# EAGLE design QFP_32U4 (EAGLE 7.2.0)
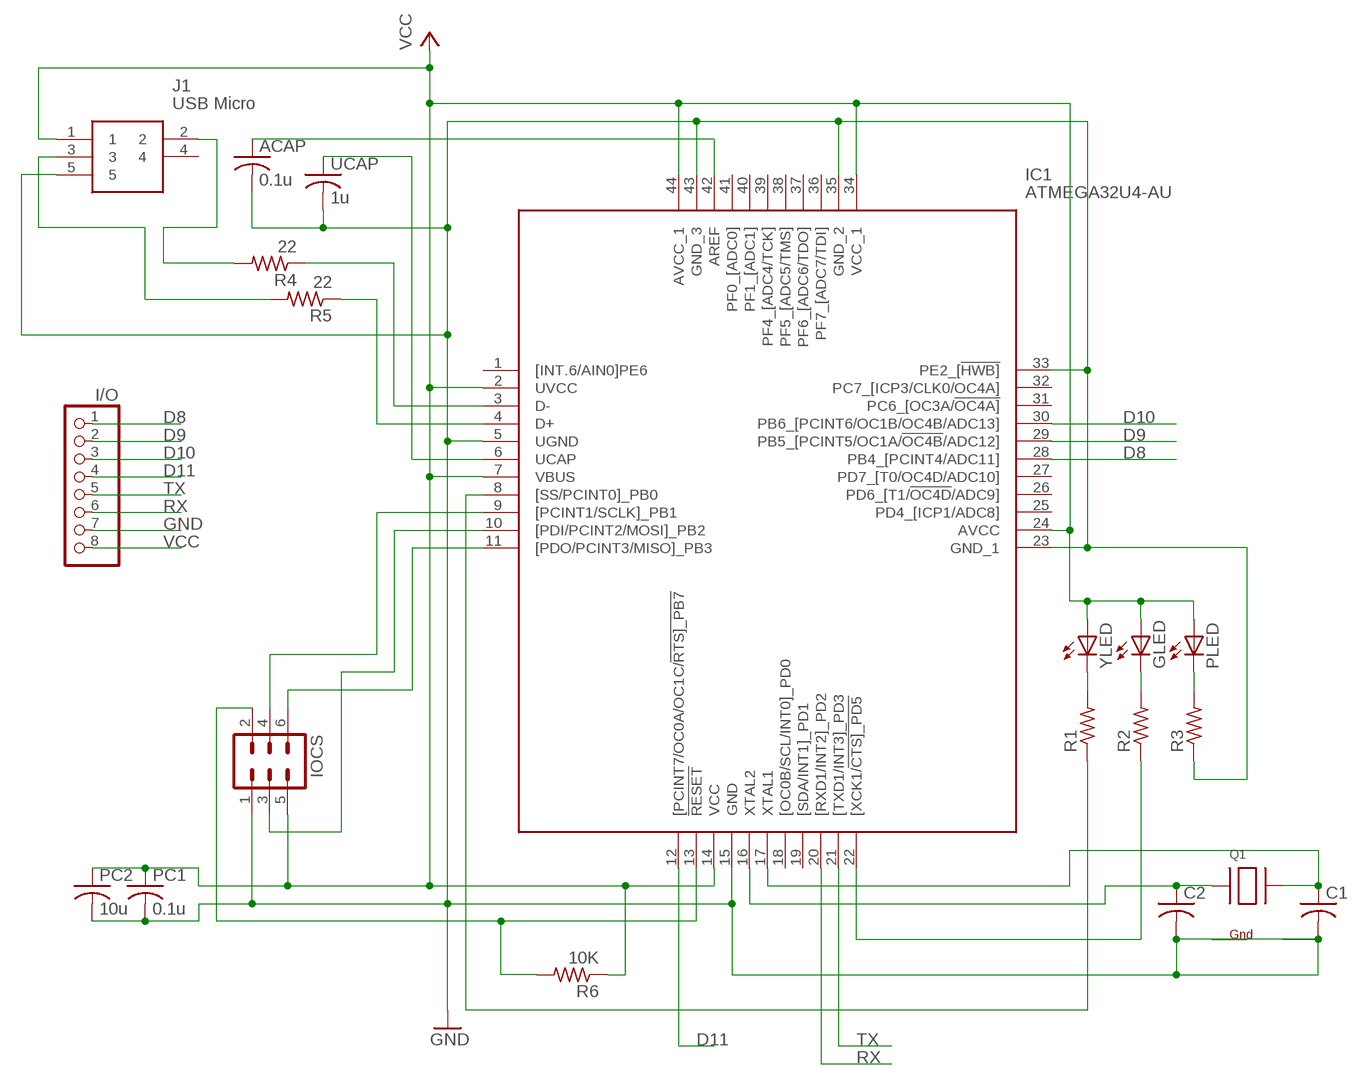
[diagram p0: schematic, sheet 1]

## Parts
ACAP  0.1u  C-USC0805  [C0805]
C1  C-USC0805  [C0805]
C2  C-USC0805  [C0805]
GLED  LEDCHIP-LED0805  [CHIP-LED0805]
I/O  PINHD-1X8CLEANBIG  [1X08-CLEANBIG]
IC1  ATMEGA32U4-AU  [QFP80P1200X1200X120-44N]
IOCS  MA03-2  [MA03-2]
J1  USB Micro  10104110-0001LF  [10104110-0001LF]
PC1  0.1u  C-USC0805  [C0805]
PC2  10u  C-USC0805  [C0805]
PLED  LEDCHIP-LED0805  [CHIP-LED0805]
Q1  XTAL-4-3225  [NX3225]
R1  R-US_M0805  [M0805]
R2  R-US_M0805  [M0805]
R3  R-US_M0805  [M0805]
R4  22  R-US_M0805  [M0805]
R5  22  R-US_M0805  [M0805]
R6  10K  R-US_M0805  [M0805]
UCAP  1u  C-USC0805  [C0805]
YLED  LEDCHIP-LED0805  [CHIP-LED0805]

## Nets
D8: I/O.1 IC1.28(PB4_[PCINT4/ADC11])
D9: I/O.2 IC1.29(PB5_[PCINT5/OC1A/!OC4B!/ADC12])
D10: I/O.3 IC1.30(PB6_[PCINT6/OC1B/OC4B/ADC13])
D11: I/O.4 IC1.12([PCINT7/OC0A/OC1C/!RTS]_PB7)
GND: ACAP.2 C1.2 C2.2 I/O.7 IC1.5(UGND) IC1.15(GND) IC1.23(GND_1) IC1.33(PE2_[!HWB]) IC1.35(GND_2) IC1.43(GND_3) IOCS.1 J1.5 PC1.2 PC2.2 Q1.2(G2) Q1.4(G1) R3.1 UCAP.2
N$3: IC1.3(D-) R4.1
N$4: IC1.4(D+) R5.1
N$5: J1.2 R4.2
N$6: IC1.6(UCAP) UCAP.1
N$7: R1.2 YLED.C
N$8: IC1.8([SS/PCINT0]_PB0) R1.1
N$9: IC1.9([PCINT1/SCLK]_PB1) IOCS.4
N$10: IC1.10([PDI/PCINT2/MOSI]_PB2) IOCS.3
N$11: IC1.11([PDO/PCINT3/MISO]_PB3) IOCS.6
N$13: IC1.13(!RESET) IOCS.2 R6.2
N$14: J1.3 R5.2
N$15: GLED.C R2.2
N$16: C2.1 IC1.16(XTAL2) Q1.1(X1)
N$22: IC1.22([XCK1/!CTS]_PD5) R2.1
N$23: PLED.C R3.2
N$35: C1.1 IC1.17(XTAL1) Q1.3(X2)
N$42: ACAP.1 IC1.42(AREF)
RX: I/O.6 IC1.20([RXD1/INT2]_PD2)
TX: I/O.5 IC1.21([TXD1/INT3]_PD3)
VCC: GLED.A I/O.8 IC1.2(UVCC) IC1.7(VBUS) IC1.14(VCC) IC1.24(AVCC) IC1.34(VCC_1) IC1.44(AVCC_1) IOCS.5 J1.1 PC1.1 PC2.1 PLED.A R6.1 YLED.A
Unconnected: IC1.1([INT.6/AIN0]PE6) IC1.18([OC0B/SCL/INT0]_PD0) IC1.19([SDA/INT1]_PD1) IC1.25(PD4_[ICP1/ADC8]) IC1.26(PD6_[T1/!OC4D!/ADC9]) IC1.27(PD7_[T0/OC4D/ADC10]) IC1.31(PC6_[OC3A/!OC4A]) IC1.32(PC7_[ICP3/CLK0/OC4A]) IC1.36(PF7_[ADC7/TDI]) IC1.37(PF6_[ADC6/TDO]) IC1.38(PF5_[ADC5/TMS]) IC1.39(PF4_[ADC4/TCK]) IC1.40(PF1_[ADC1]) IC1.41(PF0_[ADC0]) J1.4

## Library data of the parts
ACAP C1 C2 PC1 PC2 UCAP = adafruit:C-US: CAPACITOR, American symbol
GLED PLED YLED = adafruit:LED: LED OSRAM: - CHIPLED LG R971, LG N971, LY N971, LG Q971, LY Q971, LO R971, LY R971 LH N974, LH R974 LS Q976, LO Q976, LY Q976 LO Q996 - Hyper CHIPLED LW Q18S LB Q993, LB Q99A, LB R99A - SideLED LS A670, LO A670, LY A670, LG A670, LP A670 LB A673, LV A673, LT A673, LW A673 LH A674 LY A675 LS A676, LA A676, LO A676, LY A676, LW A676 LS A679, LY A679, LG A679 - Hyper Micro SIDELED® LS Y876, LA Y876, LO Y876, LY Y876 LT Y87S - SmartLED LW L88C, LW L88S LB L89C, LB L89S, LG L890 LS L89K, LO L89K, LY L89K LS L896, LA L896, LO L896, LY L896 - TOPLED LS T670, LO T670, LY T670, LG T670, LP T670 LSG T670, LSP T670, LSY T670, LOP T670, LYG T670 LG T671, LOG T671, LSG T671 LB T673, LV T673, LT T673, LW T673 LH T674 LS T676, LA T676, LO T676, LY T676, LB T676, LH T676, LSB T676, LW T676 LB T67C, LV T67C, LT T67C, LS T67K, LO T67K, LY T67K, LW E67C LS E67B, LA E67B, LO E67B, LY E67B, LB E67C, LV E67C, LT E67C LW T67C LS T679, LY T679, LG T679 LS T770, LO T770, LY T770, LG T770, LP T770 LB T773, LV T773, LT T773, LW T773 LH T774 LS E675, LA E675, LY E675, LS T675 LS T776, LA T776, LO T776, LY T776, LB T776 LHGB T686 LT T68C, LB T68C - Hyper Mini TOPLED® LB M676 - Mini TOPLED Santana® LG M470 LS M47K, LO M47K, LY M47K Source: http://www.osram.convergy.de/
I/O = adafruit:PINHD-1X8: PIN HEADER
IC1 = ATMEGA32U4-AU:ATMEGA32U4-AU: MCU AVR 32K FLASH 16MHZ 44-TQFP Atmel ATMEGA32U4-AU, 8bit AVR Microcontroller, 16MHz, 1 kB, 32 kB Flash, 44-Pin TQFP Source: Datasheet <http://www.atmel.com/images/atmel-7766-8-bit-avr-atmega16u4-32u4_summary.pdf>; ARROW_PART_NUMBER: ATMEGA32U4-AU; ARROW_PRICE-STOCK: https://www.arrow.com/en/products/atmega32u4-au/microchip-technology; DESCRIPTION: MCU AVR 32K FLASH 16MHZ 44-TQFP Atmel ATMEGA32U4-AU, 8bit AVR Microcontroller, 16MHz, 1 kB, 32 kB Flash, 44-Pin TQFP; HEIGHT: 1.2mm; MANUFACTURER_NAME: Microchip; MANUFACTURER_PART_NUMBER: ATMEGA32U4-AU; RS_PART_NUMBER: 1310289P; RS_PRICE-STOCK: http://uk.rs-online.com/web/p/products/1310289P
IOCS = con-lstb:MA03-2: PIN HEADER; OC_FARNELL: unknown; OC_NEWARK: unknown
J1 = USB-Micro_3:10104110-0001LF: USB Connectors 5P Quick Connect Micro USB TypeB Rcpt Source: Datasheet <http://docs-emea.rs-online.com/webdocs/0ed1/0900766b80ed1ae6.pdf>; ALLIED_NUMBER: 70236824; ALLIED_PRICE-STOCK: http://www.alliedelec.com/fci-10104110-0001lf/70236824/; ARROW_PART_NUMBER: 10104110-0001LF; ARROW_PRICE-STOCK: https://www.arrow.com/en/products/10104110-0001lf/amphenol-fci; DESCRIPTION: USB Connectors 5P Quick Connect Micro USB TypeB Rcpt; HEIGHT: mm; MANUFACTURER_NAME: FCI; MANUFACTURER_PART_NUMBER: 10104110-0001LF; RS_PART_NUMBER: 1738645; RS_PRICE-STOCK: http://uk.rs-online.com/web/p/products/1738645
Q1 = adafruit:XTAL-4: Classic 4-pin 3.2 x 2.5mm crystal
R1-R6 = adafruit:R-US_: RESISTOR, American symbol

## Net classes
0 default: width 0.3 mm, clearance 0.003 mm

## Board
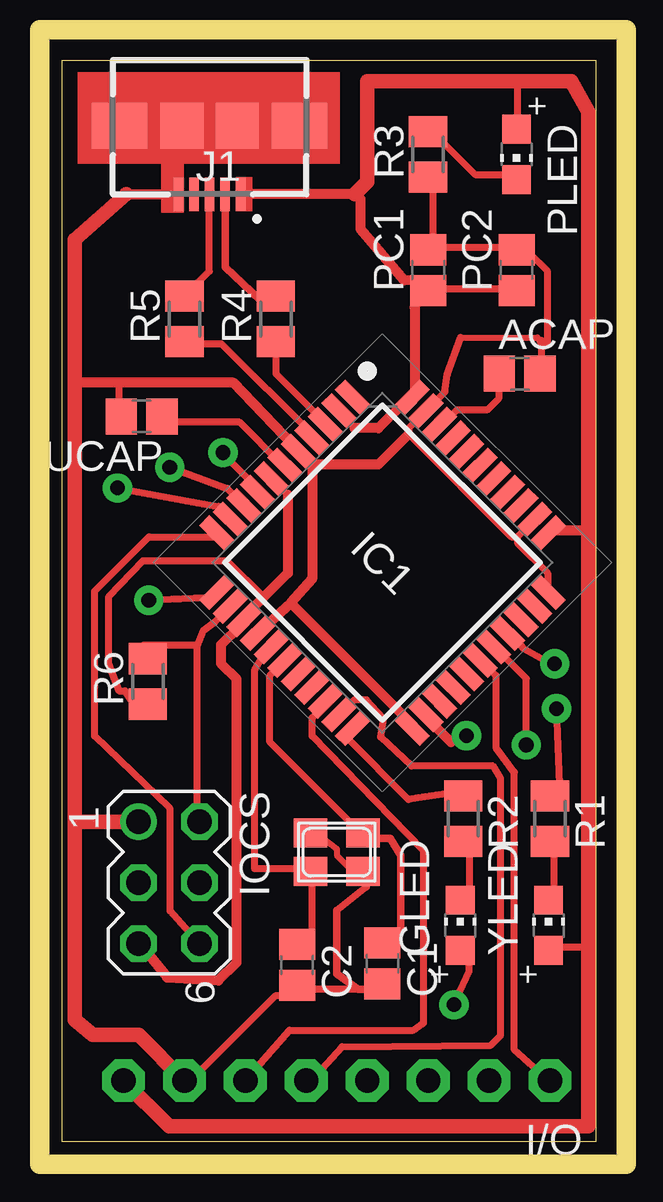
[diagram p1: board, top side]
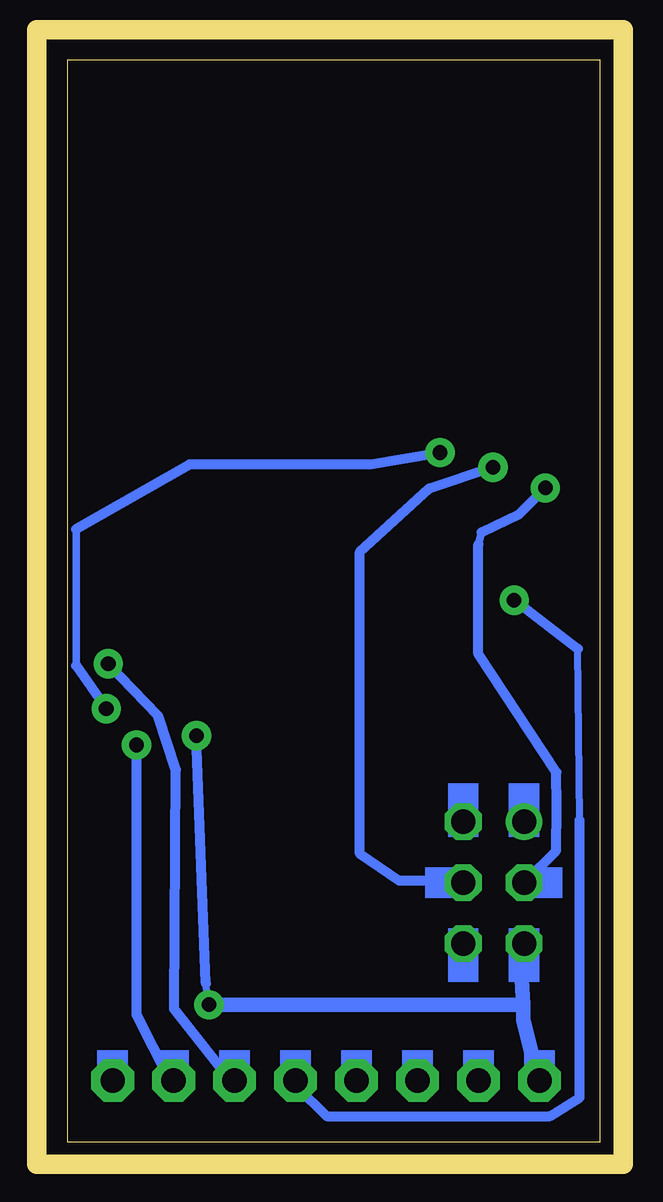
[diagram p2: board, bottom side, seen from below]

Size 22.23 x 45.09 mm. Coordinates in mm from the lower left corner, seen from the top.
Outline: 22.23,45.09 22.23,0 0,0 0,45.09 22.23,45.09
Copper layers (1*16): Top 0.035mm / dielectric 1.5mm / Bottom 0.035mm
Design rules "default *": minimum track width 10mil, minimum drill 24mil, track to track 8mil, track to pad 8mil, pad to pad 8mil, via to via 8mil, smd to smd 8mil, copper to edge 40mil, drill to drill 8mil, minimum pad ring 10mil, minimum via ring 8mil, stop-mask expansion 4mil, vias tented up to drill 0mil, thermal gap 10mil
Milling: 4 lines

### Footprints (pad centres in the part's own frame; a part is rotated, then mirrored left to right if it is on the bottom)
C0805 = smd 1.3 x 1.5: 1 -0.85,0; 2 0.85,0
CHIP-LED0805 = smd 1.2 x 1.2: A 0,-1.05; C 0,1.05
1X08-CLEANBIG = drill 1.016 pad 1.778 octagon: 1 -8.89,0; 2 -6.35,0; 3 -3.81,0; 4 -1.27,0; 5 1.27,0; 6 3.81,0; 7 6.35,0; 8 8.89,0
QFP80P1200X1200X120-44N = smd 1.5 x 0.6: 1 -5.75,4; 2 -5.75,3.2; 3 -5.75,2.4; 4 -5.75,1.6; 5 -5.75,0.8; 6 -5.75,0; 7 -5.75,-0.8; 8 -5.75,-1.6; 9 -5.75,-2.4; 10 -5.75,-3.2; 11 -5.75,-4; 23 5.75,-4; 24 5.75,-3.2; 25 5.75,-2.4; 26 5.75,-1.6; 27 5.75,-0.8; 28 5.75,0; 29 5.75,0.8; 30 5.75,1.6; 31 5.75,2.4; 32 5.75,3.2; 33 5.75,4 | smd 0.6 x 1.5: 12 -4,-5.75; 13 -3.2,-5.75; 14 -2.4,-5.75; 15 -1.6,-5.75; 16 -0.8,-5.75; 17 0,-5.75; 18 0.8,-5.75; 19 1.6,-5.75; 20 2.4,-5.75; 21 3.2,-5.75; 22 4,-5.75; 34 4,5.75; 35 3.2,5.75; 36 2.4,5.75; 37 1.6,5.75; 38 0.8,5.75; 39 0,5.75; 40 -0.8,5.75; 41 -1.6,5.75; 42 -2.4,5.75; 43 -3.2,5.75; 44 -4,5.75
MA03-2 = drill 1.016: 1 -2.54,-1.27 | drill 1.016 octagon: 2 -2.54,1.27; 3 0,-1.27; 4 0,1.27; 5 2.54,-1.27; 6 2.54,1.27
10104110-0001LF = smd 0.4 x 1.4: 1 2.73,5.6; 2 3.38,5.6; 3 4.03,5.6; 4 4.68,5.6; 5 5.33,5.6 | smd 2.3 x 1.9: 6 0.28,2.75; 7 7.78,2.75 | smd 1.8 x 1.9: 8 2.88,2.75; 9 5.18,2.75
NX3225 = smd 1.4 x 1.2: 1 -1.1,-0.8; 2 1.1,-0.8; 3 1.1,0.8; 4 -1.1,0.8
M0805 = smd 1.3 x 1.6: 1 -0.95,0; 2 0.95,0

### Placement (x,y rotation side)
ACAP  19.05,32 0 top
C1  13.34,7.43 270 top
C2  9.78,7.37 270 top
GLED  16.57,9.02 0 top
I/O  11.43,2.54 180 top
IC1  13.34,24.13 315 top
IOCS  4.45,10.8 270 top
J1  10.16,45.09 180 top
PC1  15.24,36.32 90 top
PC2  18.92,36.32 90 top
PLED  18.92,41.15 180 top
Q1  11.43,12.06 0 top
R1  20.32,13.46 270 top
R2  16.7,13.46 270 top
R3  15.24,41.15 90 top
R4  8.89,34.29 90 top
R5  5.08,34.29 90 top
R6  3.56,19.18 90 top
UCAP  3.3,30.23 180 top
YLED  20.26,9.02 0 top

### Tracks (layer width: path | path; a pad name or v marks a point on that pad's centre or on a via)
D8
  Top 0.3: IC1.28 17.45,19.93 18.07,19.43 18.07,16.41 18.83,15.4 18.83,3.82 20.21,2.56 I/O.1
D9  (via drill 0.61)
  Top 0.3: v19.33,16.53 19.33,19.3 18.2,20.43 IC1.29
  Bottom 0.3: 17.95,2.56 I/O.2
  Bottom 0.406: v19.33,16.53 19.33,5.28 17.95,2.56
D10  (via drill 0.61)
  Top 0.3: v20.51,19.92 20.12,20.03 19.22,20.54 18.45,21.44 IC1.30
  Bottom 0.3: 15.43,2.56 I/O.3
  Bottom 0.406: v20.51,19.92 18.43,17.75 17.69,15.51 17.76,5.53 15.43,2.56
D11  (via drill 0.61)
  Top 0.3: v3.6,22.57 6.37,22.69 IC1.12
  Bottom 0.3: 0.86,13.41 0.94,20.53 | 12.66,2.31 I/O.4
  Bottom 0.406: 0.94,20.53 v3.6,22.57 | 0.86,13.41 0.86,1.83 2.1,1.05 11.41,1.05 12.66,2.31
GND
  Top 0.254: Q1.4 10.8,12.48 10.88,12.61 11.43,12.19 11.43,11.94 12.07,11.3 12.49,11.3 Q1.2 | 16.59,33.51 19.78,33.51 19.96,33.17
  Top 0.3: 10.4,28.23 9.9,28.73 IC1.5 9.65,28.98 | 8.39,21.44 IC1.15 | 14.55,17.41 IC1.23 | 15.43,37.29 15.43,40.05 R3.1 | 15.43,37.29 18.7,37.29 PC2.2 18.95,37.03 19.46,37.03 20.21,36.28 20.21,33.26 19.96,33.39 19.96,33.17 19.96,32.25 ACAP.2 | 15.43,37.29 PC1.2 | 18.95,25.21 18.95,24.96 20.21,23.7 20.21,22.94 IC1.33 | 18.95,25.21 19.46,25.71 IC1.35 | 18.95,25.21 18.7,25.21 14.43,29.49 14.43,29.74 14.93,30.24 IC1.43 15.18,30.49 15.94,31.25 16.04,31.97 16.59,33.51 | 12.66,10.62 12.66,11.12 Q1.2 | 13.92,6.34 13.42,6.34 C1.2 13.17,6.34 10.4,6.34 C2.2 10.15,6.09 8.89,6.09 5.37,2.56 I/O.7 | 2.35,31.63 2.35,30.24 UCAP.2
  Top 0.305: 13.92,6.34 12.33,6.34 11.43,6.98 11.43,9.64 12.66,10.62
  Top 0.406: 9.52,22.44 10.4,23.45 10.4,28.23 13.17,28.23 14.43,29.49 | 9.52,22.44 8.39,21.44 | 9.52,22.44 14.55,17.41 | 0.51,31.63 2.35,31.63 7.12,31.63 9.65,28.98 | 2.66,39.48 J1.5
  Top 0.61: 2.66,39.48 0.51,37.59 0.51,31.63 0.51,13.34 | IOCS.1 0.51,13.34 | 0.51,13.34 0.51,5.08 1.27,4.45 3.18,4.45 I/O.7
N$3
  Top 0.3: IC1.3 10.9,29.99 8.89,32 8.89,33.26 R4.1
N$4
  Top 0.3: IC1.4 10.4,29.49 6.63,33.26 5.12,33.26 R5.1
N$5
  Top 0.305: J1.2 6.78,36.45 8.26,35.05 8.7,35.05 R4.2
N$6
  Top 0.3: IC1.6 9.14,28.23 7.38,29.99 4.36,29.99 UCAP.1
N$7
  Top 0.3: YLED.C 20.46,10.11 20.46,12.38 R1.2
N$8  (via drill 0.61)
  Top 0.3: v6.69,28.72 7.13,28.23 8.14,27.22 IC1.8 | v20.59,18.05 20.71,14.89 20.46,14.64 R1.1
  Bottom 0.305: 21.84,25.53 21.84,19.84
  Bottom 0.406: v6.69,28.72 9.65,28.23 17.11,28.23 21.84,25.53 | 21.84,19.84 v20.59,18.05
N$9  (via drill 0.61)
  Top 0.3: v4.47,28.11 6.88,27.22 7.38,26.72 IC1.9
  Bottom 0.3: 5.87,10.87 IOCS.4
  Bottom 0.406: v4.47,28.11 7.13,27.22 10.03,24.58 10.03,12 8.39,10.87 5.87,10.87
N$10  (via drill 0.61)
  Top 0.3: v2.29,27.25 6.49,26.47 IC1.10
  Bottom 0.3: 3.1,10.87 IOCS.3
  Bottom 0.305: 5.08,24.89 4.95,25.4
  Bottom 0.406: 3.1,10.87 1.85,12.12 1.82,13.98 1.83,15.4 5.08,20.32 5.08,24.89 | 4.95,25.4 3.38,26.16 v2.29,27.25
N$11
  Top 0.3: IC1.11 6.37,25.21 3.61,25.21 1.34,22.94 1.34,16.91 4.49,13.89 4.49,9.61 5.62,8.35 IOCS.6
N$13
  Top 0.3: IC1.13 6.88,22.19 6.37,21.69 5.87,21.3 5.62,20.68 | 5.62,20.68 5.62,13.38 IOCS.2 | 5.62,20.68 3.36,20.68 R6.2
N$14
  Top 0.3: J1.3 6.12,39.3 6.12,36.28 5.12,35.27 R5.2
N$15
  Top 0.3: GLED.C 16.94,10.11 16.94,12.38 R2.2
N$16
  Top 0.3: C2.1 10.4,7.85 10.4,11.12 Q1.1 10.15,11.37 8.01,11.37 8.01,11.87 8.01,19.68 8.64,20.68 IC1.16
N$22
  Top 0.3: IC1.22 12.16,17.16 11.9,16.78 14.42,14.26 16.94,14.64 R2.1
N$23
  Top 0.3: PLED.C 18.7,40.3 17.19,40.3 15.43,42.07 R3.2
N$35
  Top 0.3: 12.16,12.63 12.41,12.63 Q1.3 12.41,12.88 8.64,16.65 8.64,19.42 9.14,19.93 IC1.17 | 13.17,7.85 C1.1
  Top 0.305: 12.16,12.63 13.66,12.63 14.1,11.94 14.1,8.89 13.97,8.76 13.97,8.47 C1.1
N$42
  Top 0.3: IC1.42 15.94,29.99 16.44,30.49 17.7,30.49 18.2,31 ACAP.1
RX
  Top 0.3: IC1.20 10.9,18.16 10.4,17.66 10.4,16.91 15.05,12.12 15.05,4.95 14.62,4.64 9.46,4.64 7.63,2.56 I/O.6
TX
  Top 0.3: IC1.21 11.66,17.91 12.16,18.41 12.66,18.41 13.38,17.62 13.25,16.86 14.55,15.65 17.95,15.65 18.26,15.14 18.26,4.43 17.85,4.01 11.66,3.95 10.4,2.56 I/O.5
VCC  (via drill 0.61)
  Top 0.3: 9.39,26.97 8.89,27.47 IC1.7 | 7.63,21.94 IC1.14 7.38,21.69 | 8.39,22.69 6.88,24.2 3.36,24.2 1.91,22.69 1.91,19.93 2.35,18.79 2.6,18.79 2.85,18.41 R6.1 | v16.31,5.7 16.94,7.09 16.94,7.85 GLED.A | 15.18,17.66 IC1.24 | 3.36,8.1 IOCS.5 | 12.16,29.74 11.66,30.24 IC1.2 | 14.43,31 IC1.44 14.68,31.25 | PC1.1 15.43,35.52 18.7,35.52 PC2.1 | 14.68,34.77 15.18,35.27 PC1.1 | 18.95,44.2 18.95,42.32 PLED.A | 21.91,8.1 20.71,8.1 YLED.A | 20.46,25.46 IC1.34 | 14.68,35.93 15.18,35.52 PC1.1 | 12.41,39.3 12.2,39.51
  Top 0.406: 7.63,21.94 8.39,22.69 9.39,23.7 9.39,26.97 | 15.18,17.66 16.19,16.65 v16.83,16.92 | 3.36,8.1 4.36,6.84 6.5,6.71 7.26,7.47 7.26,19.28 6.6,19.93 6.6,20.7 7.38,21.48 7.38,21.69 | 12.16,29.74 13.17,29.74 14.43,31 | 14.68,34.77 14.68,31.25 | 21.91,25.46 20.46,25.46 | 14.68,35.93 14.22,35.9 12.41,38.04 12.41,39.3 | 12.18,39.48 J1.1
  Top 0.61: 12.18,39.48 12.2,39.51 12.7,40.01 12.7,44.2 18.95,44.2 21.21,44.2 21.91,42.93 21.91,25.46 21.91,8.1 21.91,0.63 4.45,0.63 I/O.8
  Bottom 0.3: 3.36,8.1 IOCS.5 | v16.31,5.7 16.44,6.59 | 2.6,2.56 I/O.8
  Bottom 0.406: 16.44,6.59 v16.83,16.92
  Bottom 0.61: 3.21,5.7 v16.31,5.7 | 3.36,8.1 3.21,5.7 | 3.21,5.7 3.21,5.08 2.6,2.56
(copper drawn outside any net)
  shapes: Bottom area x14, Top area x4